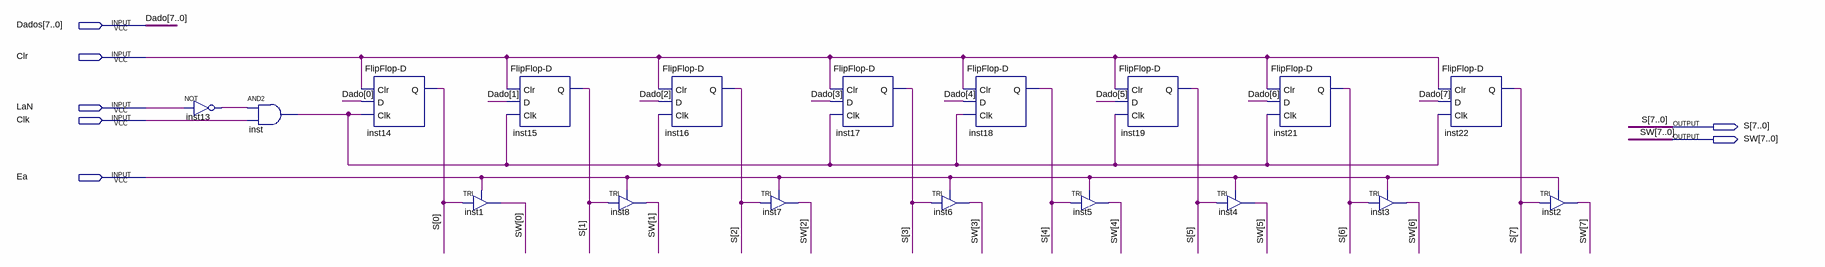
[diagram p0: schematic sheet]
// Quartus schematic Acumulador.bdf as structural Verilog: 18 symbols, 7 pins
module Acumulador (
  input  [7:0] Dados,
  input  Clr,
  input  LaN,
  input  Clk,
  input  Ea,
  output [7:0] S,
  output [7:0] SW
);

  wire inst13_out, inst_out;

  not inst13 (inst13_out, LaN);
  and inst (inst_out, inst13_out, Clk);
  \FlipFlop-D  inst14 (.Clr(Clr), .D(Dados[0]), .Clk(inst_out), .Q(S[0]));
  TRI inst1 (.IN(S[0]), .OE(Ea), .OUT(SW[0]));
  \FlipFlop-D  inst15 (.Clr(Clr), .D(Dados[1]), .Clk(inst_out), .Q(S[1]));
  TRI inst8 (.IN(S[1]), .OE(Ea), .OUT(SW[1]));
  \FlipFlop-D  inst16 (.Clr(Clr), .D(Dados[2]), .Clk(inst_out), .Q(S[2]));
  TRI inst7 (.IN(S[2]), .OE(Ea), .OUT(SW[2]));
  \FlipFlop-D  inst17 (.Clr(Clr), .D(Dados[3]), .Clk(inst_out), .Q(S[3]));
  \FlipFlop-D  inst18 (.Clr(Clr), .D(Dados[4]), .Clk(inst_out), .Q(S[4]));
  TRI inst6 (.IN(S[3]), .OE(Ea), .OUT(SW[3]));
  TRI inst5 (.IN(S[4]), .OE(Ea), .OUT(SW[4]));
  \FlipFlop-D  inst19 (.Clr(Clr), .D(Dados[5]), .Clk(inst_out), .Q(S[5]));
  TRI inst4 (.IN(S[5]), .OE(Ea), .OUT(SW[5]));
  \FlipFlop-D  inst21 (.Clr(Clr), .D(Dados[6]), .Clk(inst_out), .Q(S[6]));
  TRI inst3 (.IN(S[6]), .OE(Ea), .OUT(SW[6]));
  \FlipFlop-D  inst22 (.Clr(Clr), .D(Dados[7]), .Clk(inst_out), .Q(S[7]));
  TRI inst2 (.IN(S[7]), .OE(Ea), .OUT(SW[7]));

  // Other names for the same wires on the sheet: Dado[7:0] = Dados
endmodule
